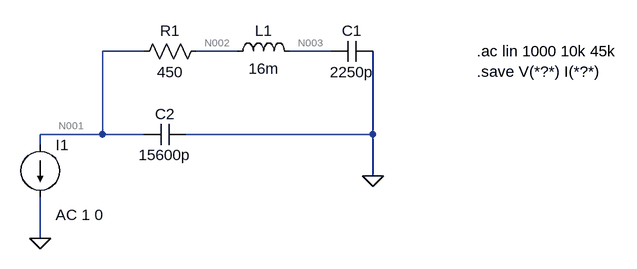
[diagram p0: schematic antennae_33_28_20.asc]
antennae_33_28_20.asc, the LTspice schematic file:
Version 4.1
SHEET 1 880 680
WIRE 128 -96 64 -96
WIRE 272 -96 208 -96
WIRE 416 -96 352 -96
WIRE 64 32 64 -96
WIRE 64 32 -32 32
WIRE 128 32 64 32
WIRE 480 32 480 -96
WIRE 480 32 192 32
WIRE -32 48 -32 32
WIRE 480 96 480 32
WIRE -32 192 -32 128
FLAG -32 192 0
FLAG 480 96 0
SYMBOL res 224 -112 R90
WINDOW 0 0 56 VBottom 2
WINDOW 3 32 56 VTop 2
SYMATTR InstName R1
SYMATTR Value 450
SYMBOL ind 256 -80 R270
WINDOW 0 32 56 VTop 2
WINDOW 3 5 56 VBottom 2
SYMATTR InstName L1
SYMATTR Value 16m
SYMATTR SpiceLine Rser=1m
SYMBOL cap 480 -112 R90
WINDOW 0 0 32 VBottom 2
WINDOW 3 32 32 VTop 2
SYMATTR InstName C1
SYMATTR Value 2250p
SYMBOL cap 192 16 R90
WINDOW 0 0 32 VBottom 2
WINDOW 3 32 32 VTop 2
SYMATTR InstName C2
SYMATTR Value 15600p
SYMBOL current -32 48 R0
WINDOW 123 24 108 Left 2
WINDOW 39 0 0 Left 0
SYMATTR Value2 AC 1 0
SYMATTR InstName I1
SYMATTR Value ""
TEXT 640 -96 Left 2 !.ac lin 1000 10k 45k\n.save V(*?*) I(*?*)

The netlist it stands for:
* antennae_33_28_20.asc
R1 N002 N001 450
L1 N002 N003 16m Rser=1m
C1 0 N003 2250p
C2 0 N001 15600p
I1 N001 0 AC 1 0
.ac lin 1000 10k 45k
.save V(*?*) I(*?*)
.backanno
.end

* Results of the author's LTspice run, read from the files saved beside the schematic
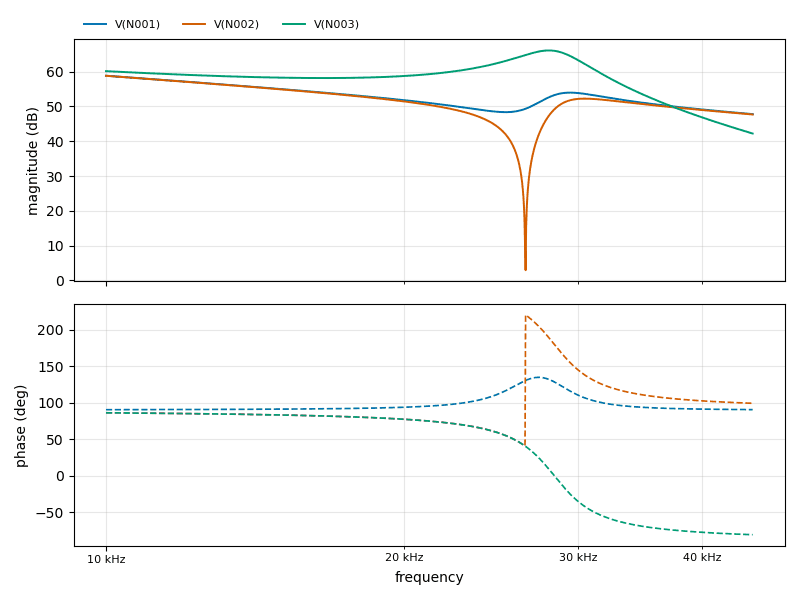
[diagram p1: AC Analysis of antennae_33_28_20.asc, plotted from the saved traces]
* AC Analysis, 1 run:
*   V(N001): 58.83 dB at 10 kHz, 47.79 dB at 45 kHz, peak 58.83 dB at 10 kHz, 3 dB below the peak at 13.81 kHz
*   V(N002): 58.81 dB at 10 kHz, 47.69 dB at 45 kHz, peak 58.81 dB at 10 kHz, 3 dB below the peak at 13.76 kHz
*   V(N003): 60.14 dB at 10 kHz, 42.21 dB at 45 kHz, peak 66.09 dB at 28.01 kHz, 3 dB below the peak at 25.34 kHz and 30.07 kHz